# EasyEDA Pro project Hubbly.epro

# Schematic Hubbly
Board Name: Board1; Create Date: 2026-05-22; Page Name: P1; Project Name: Hubbly.; Schematic Name: Hubbly; Update Date: 2026-05-22; Company: EasyEDA.com; Drawn: Youssef Ayman; Page Size: A4; Version: V1.0
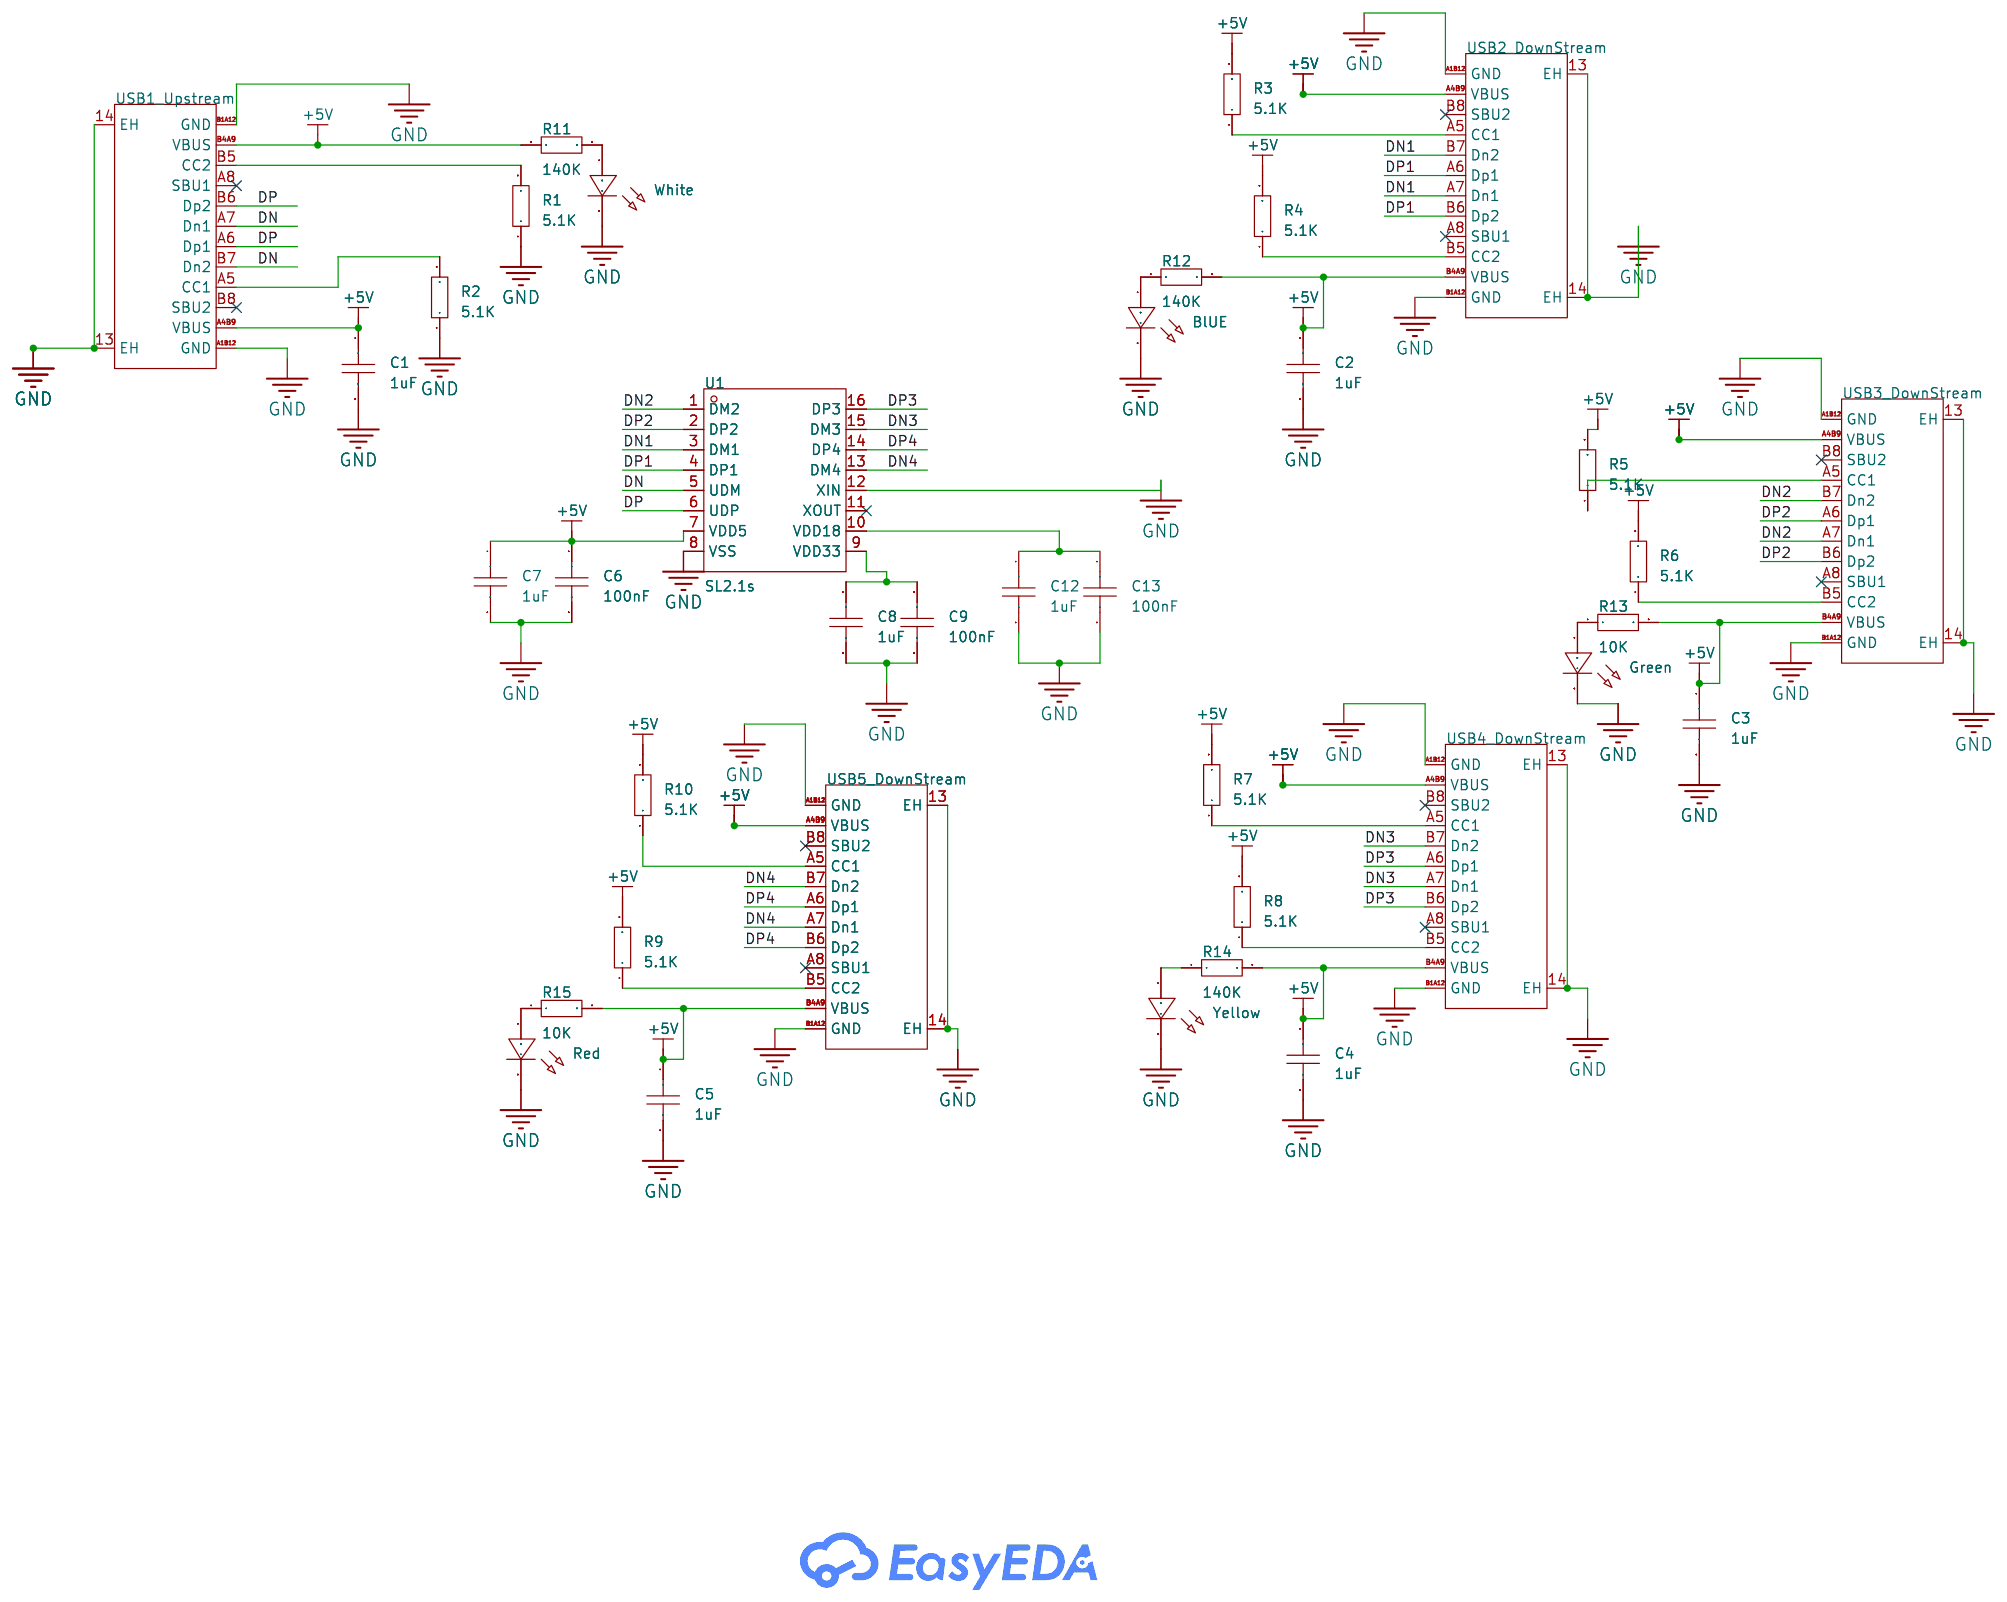
[diagram p0: schematic sheet]

## Parts
BlUE  -  [LED-TH_BD5.0-P2.54-L-RD_WHITE]
C1  1uF  [C0603]
C2  1uF  [C0603]
C3  1uF  [C0603]
C4  1uF  [C0603]
C5  1uF  [C0603]
C6  100nF  [C0603]
C7  1uF  [C0603]
C8  1uF  [C0603]
C9  100nF  [C0603]
C12  1uF  [C0603]
C13  100nF  [C0603]
Green  -  [LED-TH_BD5.0-P2.54-L-RD_WHITE]
R1  5.1K  [R0603]
R2  5.1K  [R0603]
R3  5.1K  [R0603]
R4  5.1K  [R0603]
R5  5.1K  [R0603]
R6  5.1K  [R0603]
R7  5.1K  [R0603]
R8  5.1K  [R0603]
R9  5.1K  [R0603]
R10  5.1K  [R0603]
R11  140K  [R0603]
R12  140K  [R0603]
R13  10K  [R0603]
R14  140K  [R0603]
R15  10K  [R0603]
Red  -  [LED-TH_BD5.0-P2.54-L-RD_WHITE]
U1  SL2.1s  [SSOP-16_L4.6-W2.6-P0.53-LS4.0-BL]
USB1_Upstream  TYPE-C 16PIN 2MD(073)  [USB-C-SMD_TYPE-C-16PIN-2MD-073]
USB2_DownStream  TYPE-C 16PIN 2MD(073)  [USB-C-SMD_TYPE-C-16PIN-2MD-073]
USB3_DownStream  TYPE-C 16PIN 2MD(073)  [USB-C-SMD_TYPE-C-16PIN-2MD-073]
USB4_DownStream  TYPE-C 16PIN 2MD(073)  [USB-C-SMD_TYPE-C-16PIN-2MD-073]
USB5_DownStream  TYPE-C 16PIN 2MD(073)  [USB-C-SMD_TYPE-C-16PIN-2MD-073]
White  -  [LED-TH_BD5.0-P2.54-L-RD_WHITE]
Yellow  -  [LED-TH_BD5.0-P2.54-L-RD_WHITE]

## Library data of the parts
BlUE Green Red White Yellow = LED_TH-B_5mm: Supplier Footprint: Through
C1-C9 C12 C13 = CAP_0603: Supplier Footprint: 0603
R1-R15 = Res_0603: Supplier Footprint: 0603
U1 = SL2.1s: type:Hub USB Protocol:USB 2.0 Data Rate:- Voltage - Supply:4V~5.25V Voltage - Supply:4V~5.25V Operating Temperature:0℃~+70℃ Operating Temperature:0℃~+70℃ Memory Interface:- Current - Supply:120mA Quiescent Supply Current:2.5mA Number of Channels:4; LCSC Part Name: USB2.0 HUB控制器集成电路; Supplier Part: C2684433; Manufacturer: CoreChips(和芯润德); Supplier Footprint: SSOP-16; JLCPCB Part Class: Extended Part; Datasheet: https://item.szlcsc.com/datasheet/SL2.1s/2782346.html; Supplier: LCSC; type: Hub; USB Protocol: USB 2.0; Voltage - Supply: 4V~5.25V; Operating Temperature: 0℃~+70℃; Current - Supply: 120mA; Quiescent Supply Current: 2.5mA; Number of Channels: 4
USB1_Upstream USB2_DownStream USB3_DownStream USB4_DownStream USB5_DownStream = TYPE-C 16PIN 2MD(073): Connector Type:Type-C Protocol Standard:- Gender:Female Mounting Type:Surface Mount, Right Angle Number of Contacts:16P Number of Ports:1 Current Rating-Power:3A Voltage Rating:5V Connect-Disconnect Life:10,000 Cycles Supplementary Features:- Center Heigh; LCSC Part Name: Type-C 母 卧贴; Supplier Part: C2765186; Manufacturer: SHOU HAN(首韩); Supplier Footprint: SMD; JLCPCB Part Class: Extended Part; Datasheet: https://item.szlcsc.com/datasheet/TYPE-C%252016PIN%25202MD(073)/2901843.html; Supplier: LCSC; Connector Type: Type-C; Gender: Female; Mounting Type: Surface Mount, Right Angle; Number of Contacts: 16P; Number of Ports: 1; Current Rating-Power: 3A; Voltage Rating: 5V; Connect-Disconnect Life: 10,000 Cycles; Detection color: Black; Operating Temperature: -25℃~+85℃

## Nets
+5V: C1.1 C2.1 C3.1 C4.1 C5.1 C6.1 C7.1 R3.2 R4.2 R5.2 R6.2 R7.2 R8.2 R9.2 R10.2 R11.1 R12.2 R13.2 R14.2 R15.2 U1.7(VDD5) USB1_Upstream.A4B9(VBUS) USB1_Upstream.B4A9(VBUS) USB2_DownStream.A4B9(VBUS) USB2_DownStream.B4A9(VBUS) USB3_DownStream.A4B9(VBUS) USB3_DownStream.B4A9(VBUS) USB4_DownStream.A4B9(VBUS) USB4_DownStream.B4A9(VBUS) USB5_DownStream.A4B9(VBUS) USB5_DownStream.B4A9(VBUS)
GND: BlUE.2(A) C1.2 C2.2 C3.2 C4.2 C5.2 C6.2 C7.2 C8.2 C9.2 C12.2 C13.2 Green.2(A) R1.1 R2.1 Red.2(A) U1.8(VSS) U1.12(XIN) USB1_Upstream.13(EH) USB1_Upstream.14(EH) USB1_Upstream.A1B12(GND) USB1_Upstream.B1A12(GND) USB2_DownStream.13(EH) USB2_DownStream.14(EH) USB2_DownStream.A1B12(GND) USB2_DownStream.B1A12(GND) USB3_DownStream.13(EH) USB3_DownStream.14(EH) USB3_DownStream.A1B12(GND) USB3_DownStream.B1A12(GND) USB4_DownStream.13(EH) USB4_DownStream.14(EH) USB4_DownStream.A1B12(GND) USB4_DownStream.B1A12(GND) USB5_DownStream.13(EH) USB5_DownStream.14(EH) USB5_DownStream.A1B12(GND) USB5_DownStream.B1A12(GND) White.2(A) Yellow.2(A)
DN: U1.5(UDM) USB1_Upstream.A7(Dn1) USB1_Upstream.B7(Dn2)
DN1: U1.3(DM1) USB2_DownStream.A7(Dn1) USB2_DownStream.B7(Dn2)
DN2: U1.1(DM2) USB3_DownStream.A7(Dn1) USB3_DownStream.B7(Dn2)
DN3: U1.15(DM3) USB4_DownStream.A7(Dn1) USB4_DownStream.B7(Dn2)
DN4: U1.13(DM4) USB5_DownStream.A7(Dn1) USB5_DownStream.B7(Dn2)
DP: U1.6(UDP) USB1_Upstream.A6(Dp1) USB1_Upstream.B6(Dp2)
DP1: U1.4(DP1) USB2_DownStream.A6(Dp1) USB2_DownStream.B6(Dp2)
DP2: U1.2(DP2) USB3_DownStream.A6(Dp1) USB3_DownStream.B6(Dp2)
DP3: U1.16(DP3) USB4_DownStream.A6(Dp1) USB4_DownStream.B6(Dp2)
DP4: U1.14(DP4) USB5_DownStream.A6(Dp1) USB5_DownStream.B6(Dp2)
$1N3672: C8.1 C9.1 U1.9(VDD33)
$1N3693: C12.1 C13.1 U1.10(VDD18)
$1N4044: R11.2 White.1(C)
$1N4129: BlUE.1(C) R12.1
$1N4291: R14.1 Yellow.1(C)
$1N4469: R15.1 Red.1(C)
$1N4529: Green.1(C) R13.1
Net-(R1-2): R1.2 USB1_Upstream.B5(CC2)
Net-(R2-2): R2.2 USB1_Upstream.A5(CC1)
Net-(R3-1): R3.1 USB2_DownStream.A5(CC1)
Net-(R4-1): R4.1 USB2_DownStream.B5(CC2)
Net-(R5-1): R5.1 USB3_DownStream.A5(CC1)
Net-(R6-1): R6.1 USB3_DownStream.B5(CC2)
Net-(R7-1): R7.1 USB4_DownStream.A5(CC1)
Net-(R8-1): R8.1 USB4_DownStream.B5(CC2)
Net-(R9-1): R9.1 USB5_DownStream.B5(CC2)
Net-(R10-1): R10.1 USB5_DownStream.A5(CC1)

Not connected (* = marked no-connect by the designer): U1 11(XOUT)*; USB1_Upstream A8(SBU1)* B8(SBU2)*; USB2_DownStream A8(SBU1)* B8(SBU2)*; USB3_DownStream A8(SBU1)* B8(SBU2)*; USB4_DownStream A8(SBU1)* B8(SBU2)*; USB5_DownStream A8(SBU1)* B8(SBU2)*

# Board PCB1
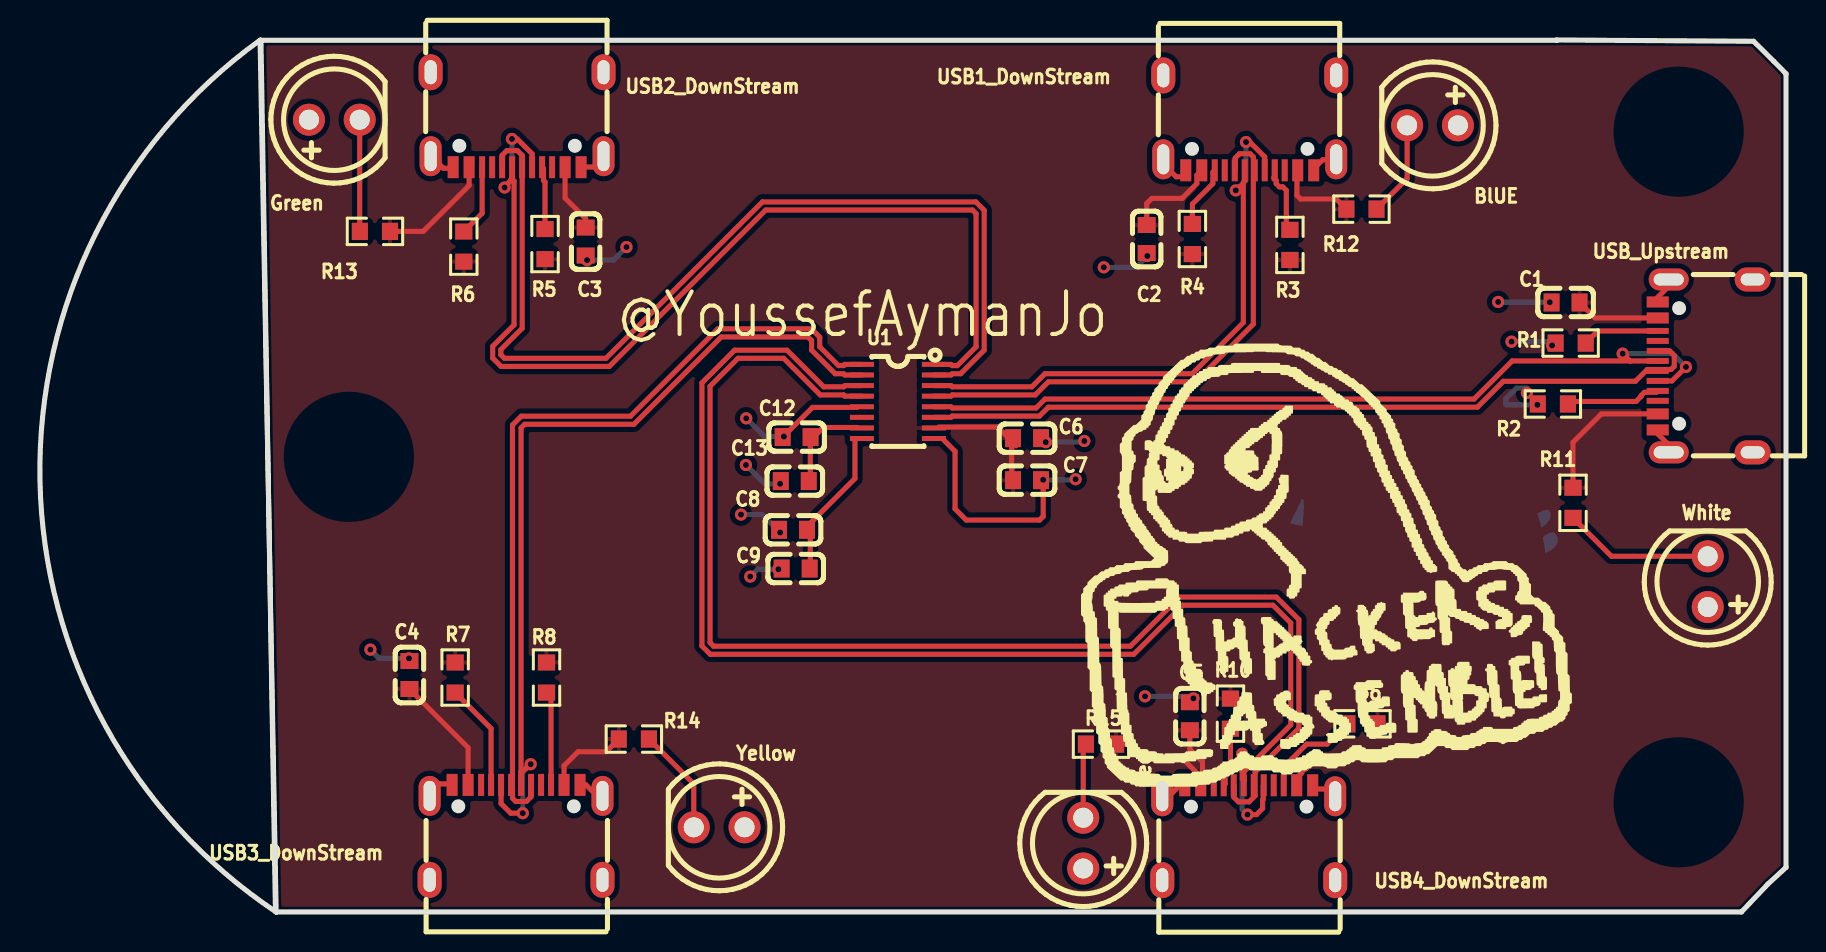
[diagram p1: board, top side]
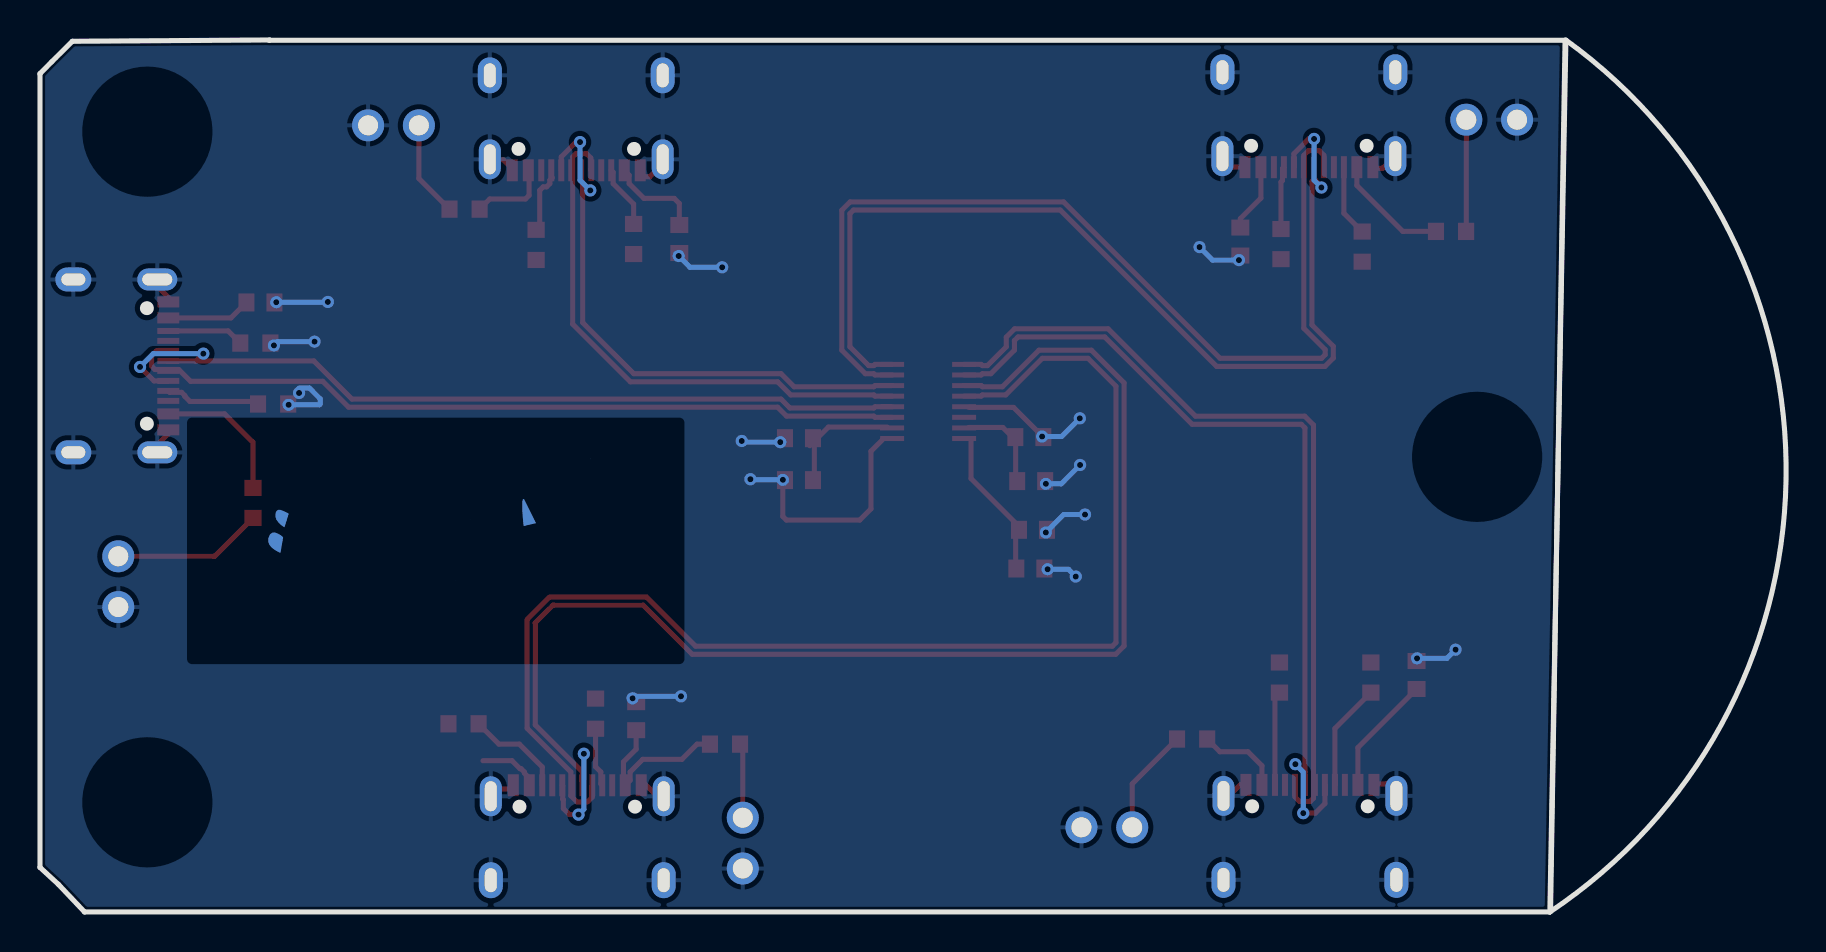
[diagram p2: board, bottom side, seen from below]

Outline 87.35 x 43.63 mm; copper layers: Top Layer, Bottom Layer. Coordinates in mm from the lower left corner of the outline.
Outline path: 11.05,43.61 arc(11.06,43.62) 11.07,43.62 75.89,43.62 75.86,43.63 85.72,43.57 arc(85.73,43.57) 85.73,43.56 86.75,42.55 87.34,41.95 arc(87.35,41.94) 87.35,41.94 87.35,2.24 arc(87.35,2.23) 87.34,2.23 86.43,1.39 85.12,0.01 arc(85.12,0) 85.11,0 11.83,0 arc(11.83,0) 11.82,0.01 11.79,0.03 arc(11.78,0.03) 11.78,0.04 11.05,43.61 ; 11.82,0 11.01,43.63 arc(0,21.6) 11.82,0
Stack: Top Layer 0.035mm / Dielectric1 1.51mm FR4 er 4.5 / Bottom Layer 0.035mm

## Design rules (mm)
net DP2: DP3
net DN1: DP2
net DP1: DP2
net DN: DP1
net DP: DP1
net DN4: DP5
net DP4: DP5
net DN3: DP4
net DP3: DP4
net DN2: DP3
template: Custom Config
spacing copperThickness1oz (default): track to track 0.102, other pairs 0.152 to 0.3
spacing copperThickness2oz: track to track 0.203, other pairs 0.152 to 0.3
track width copperThickness1oz (default): min 0.127, default 0.254, max 2.54
track width copperThickness2oz: min 0.203, default 0.254, max 2.54
differential pair differentialPair (default): width min 0.127, default 0.254, max 2.54; gap min 0.152, default 0.152
via viaSize (default): diameter min 0.5, default 0.61, max 10; hole min 0.3, default 0.305, max 6.3

## Placement (name value [footprint] x y rotation side)
BlUE  -  [LED-TH_BD5.0-P2.54-L-RD_WHITE]  69.66 39.36 0 top
C1  1uF  [C0603]  76.32 30.5 180 top
C2  1uF  [C0603]  55.37 33.67 270 top
C3  1uF  [C0603]  27.3 33.55 270 top
C4  1uF  [C0603]  18.48 11.86 90 top
C5  1uF  [C0603]  57.52 9.8 90 top
C6  100nF  [C0603]  49.38 23.71 0 top
C7  1uF  [C0603]  49.38 21.61 0 top
C8  1uF  [C0603]  37.67 19.12 180 top
C9  100nF  [C0603]  37.8 17.19 180 top
C12  1uF  [C0603]  37.85 23.76 180 top
C13  100nF  [C0603]  37.76 21.56 180 top
Green  -  [LED-TH_BD5.0-P2.54-L-RD_WHITE]  14.73 39.64 180 top
R1  5.1K  [R0603]  76.57 28.47 0 top
R2  5.1K  [R0603]  75.69 25.42 0 top
R3  5.1K  [R0603]  62.53 33.38 270 top
R4  5.1K  [R0603]  57.65 33.67 270 top
R5  5.1K  [R0603]  25.27 33.42 270 top
R6  5.1K  [R0603]  21.2 33.29 270 top
R7  5.1K  [R0603]  20.77 11.73 90 top
R8  5.1K  [R0603]  25.34 11.73 90 top
R9  5.1K  [R0603]  66.16 9.42 0 top
R10  5.1K  [R0603]  59.56 9.92 90 top
R11  140K  [R0603]  76.69 20.47 270 top
R12  140K  [R0603]  66.11 35.17 180 top
R13  10K  [R0603]  16.76 34.05 0 top
R14  140K  [R0603]  29.71 8.66 180 top
R15  10K  [R0603]  53.08 8.4 0 top
Red  -  [LED-TH_BD5.0-P2.54-L-RD_WHITE]  52.19 3.45 270 top
U1  SL2.1s  [SSOP-16_L4.6-W2.6-P0.53-LS4.0-BL]  42.92 25.55 90 top
USB1_DownStream  TYPE-C 16PIN 2MD(073)  [USB-C-SMD_TYPE-C-16PIN-2MD-073]  60.52 39.49 180 top
USB2_DownStream  TYPE-C 16PIN 2MD(073)  [USB-C-SMD_TYPE-C-16PIN-2MD-073]  23.87 39.64 180 top
USB3_DownStream  TYPE-C 16PIN 2MD(073)  [USB-C-SMD_TYPE-C-16PIN-2MD-073]  23.82 3.98 0 top
USB4_DownStream  TYPE-C 16PIN 2MD(073)  [USB-C-SMD_TYPE-C-16PIN-2MD-073]  60.47 3.97 0 top
USB_Upstream  TYPE-C 16PIN 2MD(073)  [USB-C-SMD_TYPE-C-16PIN-2MD-073]  83.31 27.32 90 top
White  -  [LED-TH_BD5.0-P2.54-L-RD_WHITE]  83.43 16.53 270 top
Yellow  -  [LED-TH_BD5.0-P2.54-L-RD_WHITE]  33.98 4.24 0 top

## Footprints (pads in the part's own frame, mm; a bottom-side part is the same pattern mirrored in y, then rotated)
C0603
  rect 0.8x0.9 smd: 1(-0.7,0) 2(0.7,0)
LED-TH_BD5.0-P2.54-L-RD_WHITE
  round 1.6 hole 1: 1(-1.27,0) 2(1.27,0)
R0603
  rect 0.806x0.864 smd: 1(-0.753,0) 2(0.753,0)
SSOP-16_L4.6-W2.6-P0.53-LS4.0-BL
  rect 0.25x1.2 smd: 1(1.855,-1.8) 2(1.325,-1.8) 3(0.795,-1.8) 4(0.265,-1.8) 5(-0.265,-1.8) 6(-0.795,-1.8) 7(-1.325,-1.8) 8(-1.855,-1.8) 9(-1.855,1.8) 10(-1.325,1.8) 11(-0.795,1.8) 12(-0.265,1.8) 13(0.265,1.8) 14(0.795,1.8) 15(1.325,1.8) 16(1.855,1.8)
USB-C-SMD_TYPE-C-16PIN-2MD-073
  oval 1.1x2 hole 0.6x1.5: 13(-4.325,1.825) 14(4.325,1.825)
  oval 1.2x1.8 hole 0.6x1.2: 13(-4.325,-2.375) 14(4.325,-2.375)
  rect 0.55x1.1 smd: A1B12(-3.2,2.375) A4B9(-2.4,2.375) B1A12(3.2,2.375) B4A9(2.4,2.375)
  rect 0.3x1.1 smd: A5(-1.25,2.375) A6(-0.25,2.375) A7(0.25,2.375) A8(1.25,2.375) B5(1.75,2.375) B6(0.75,2.375) B7(-0.75,2.375) B8(-1.75,2.375)

## Nets
+5V: C1.1 C2.1 C3.1 C4.1 C5.1 C6.1 C7.1 R3.2 R4.2 R5.2 R6.2 R7.2 R8.2 R9.2 R10.2 R11.1 R12.2 R13.2 R14.2 R15.2 U1.7 USB1_DownStream.A4B9 USB1_DownStream.B4A9 USB2_DownStream.A4B9 USB2_DownStream.B4A9 USB3_DownStream.A4B9 USB3_DownStream.B4A9 USB4_DownStream.A4B9 USB4_DownStream.B4A9 USB_Upstream.A4B9 USB_Upstream.B4A9
GND: BlUE.2 C1.2 C2.2 C3.2 C4.2 C5.2 C6.2 C7.2 C8.2 C9.2 C12.2 C13.2 Green.2 R1.1 R2.1 Red.2 U1.8 U1.12 USB1_DownStream.13 USB1_DownStream.14 USB1_DownStream.A1B12 USB1_DownStream.B1A12 USB2_DownStream.13 USB2_DownStream.14 USB2_DownStream.A1B12 USB2_DownStream.B1A12 USB3_DownStream.13 USB3_DownStream.14 USB3_DownStream.A1B12 USB3_DownStream.B1A12 USB4_DownStream.13 USB4_DownStream.14 USB4_DownStream.A1B12 USB4_DownStream.B1A12 USB_Upstream.13 USB_Upstream.14 USB_Upstream.A1B12 USB_Upstream.B1A12 White.2 Yellow.2
DN: U1.5 USB_Upstream.A7 USB_Upstream.B7
DN1: U1.3 USB1_DownStream.A7 USB1_DownStream.B7
DN2: U1.1 USB2_DownStream.A7 USB2_DownStream.B7
DN3: U1.15 USB3_DownStream.A7 USB3_DownStream.B7
DN4: U1.13 USB4_DownStream.A7 USB4_DownStream.B7
DP: U1.6 USB_Upstream.A6 USB_Upstream.B6
DP1: U1.4 USB1_DownStream.A6 USB1_DownStream.B6
DP2: U1.2 USB2_DownStream.A6 USB2_DownStream.B6
DP3: U1.16 USB3_DownStream.A6 USB3_DownStream.B6
DP4: U1.14 USB4_DownStream.A6 USB4_DownStream.B6
$1N993: R1.2 USB_Upstream.B5
$1N1024: R2.2 USB_Upstream.A5
$1N1413: R3.1 USB1_DownStream.A5
$1N1419: R4.1 USB1_DownStream.B5
$1N2562: R5.1 USB2_DownStream.A5
$1N2564: R6.1 USB2_DownStream.B5
$1N2806: R7.1 USB3_DownStream.A5
$1N2808: R8.1 USB3_DownStream.B5
$1N3085: R9.1 USB4_DownStream.B5
$1N3142: R10.1 USB4_DownStream.A5
$1N3672: C8.1 C9.1 U1.9
$1N3693: C12.1 C13.1 U1.10
$1N4044: R11.2 White.1
$1N4129: BlUE.1 R12.1
$1N4291: R14.1 Yellow.1
$1N4469: R15.1 Red.1
$1N4529: Green.1 R13.1

Pads without a net: U1 11; USB1_DownStream A8 B8; USB2_DownStream A8 B8; USB3_DownStream A8 B8; USB4_DownStream A8 B8; USB_Upstream A8 B8

## Via types
v1: diameter 0.61, hole 0.305, Top Layer to Bottom Layer, 36 vias

## Routing (per net, layer and track width the routed paths; a pad name or vN(x,y) marks a point on that pad's centre or on a via; arc(x,y) is an arc through that point)
+5V: length 57.2
  Top Layer w0.254: C5.1 57.52,8.15 58.16,7.51 58.16,6.43 USB4_DownStream.A4B9 57.82,6.59 57.82,7.01 57.19,7.64 55.24,7.64 54.48,8.4 R15.2 ; USB2_DownStream.B4A9 21.47,36.35 19.17,34.05 R13.2 ; C1.1 77.8,29.72 USB_Upstream.B4A9 ; USB2_DownStream.A4B9 26.27,35.72 27.3,34.69 C3.1 ; 48.61,23.56 48.61,21.57 ; 48.61,23.56 47.9,24.26 44.97,24.26 ; 48.61,23.56 48.61,23.75 ; 48.61,23.56 48.84,23.33 ; C2.1 55.37,35.45 55.62,35.71 57.13,35.71 57.87,36.45 57.87,36.87 USB1_DownStream.B4A9 ; USB1_DownStream.A4B9 62.88,37.07 62.88,35.86 63.06,35.68 64.85,35.68 R12.2 ; 62.87,6.71 63.12,6.95 63.12,7.01 63.28,7.17 63.34,7.17 63.74,7.57 65.19,7.57 ; USB3_DownStream.B4A9 26.22,7.32 26.92,8.02 28.32,8.02 R14.2 ; USB_Upstream.A4B9 78.11,24.92 76.69,23.51 R11.1 ; USB3_DownStream.A4B9 21.42,8.22 C4.1
GND: length 57.3
  Top Layer w0.254: 27.96,5.71 27.31,6.37 27,6.37 ; 56.27,5.59 57.28,6.59 ; 45.22,23.61 45.78,23.05 45.78,20.17 46.34,19.61 50.01,19.61 50.19,19.79 50.19,21.58 ; 28.41,37.64 28.05,37.28 27.07,37.28 ; 64.86,37.64 64.17,37.64 63.67,37.14 ; 80.79,24.06 81.37,23.48 81.37,23 ; 80.76,30.59 81.8,31.63 81.8,31.65 ; 64.74,6.16 63.78,6.16 63.61,6.33 ; 20.54,6.41 20,6.41 19.43,5.85 ; 55.99,37.64 56.84,36.79 57.34,36.79 ; 20.58,37.21 20.18,37.21 19.49,37.91 ; 37.2,23.81 38.64,25.25 40.88,25.25
  Bottom Layer w0.254: v1(37.03,18.99) 36.13,19.89 v1(35.07,19.89) ; v1(52.24,23.57) 52.19,23.51 v1(50.31,23.51) ; v1(75.53,30.51) 72.96,30.51 v1(72.95,30.52) ; v1(29.34,33.27) 28.69,32.62 v1(27.37,32.62) ; v1(55.4,32.82) 54.83,32.26 v1(53.22,32.26) ; v1(35.33,24.7) 36.24,23.79 v1(37.22,23.79) ; v1(57.7,10.69) 57.6,10.79 v1(55.28,10.79) ; v1(73.61,28.54) 75.46,28.54 v1(75.65,28.35) ; v1(37.03,21.43) 36.26,21.43 v1(35.32,22.37) ; v1(51.81,21.65) 51.78,21.63 v1(50.18,21.63) ; v1(74.91,25.38) 73.37,25.38 73.33,25.42 73.33,25.68 73.87,26.22 74.39,26.22 ; v1(36.94,17.15) 35.9,17.15 v1(35.53,16.78) ; v1(18.46,12.69) 16.97,12.69 v1(16.53,13.13)
  vias: v1(74.39,25.97)
DN: length 43
  Top Layer w0.254: v1(82.34,27.27) 81.64,26.57 USB_Upstream.B7 ; 81.01,27.57 USB_Upstream.A7 79.56,27.57 ; U1.5 45.57,25.28 45.64,25.22 49.83,25.22 50.28,25.66 71.74,25.66 73.65,27.57 79.54,27.57 ; v1(79.18,27.94) 79.54,27.57 ; 79.54,27.57 79.56,27.55
  Bottom Layer w0.254: v1(79.18,27.94) 81.68,27.94 v1(82.34,27.27)
DN1: length 29.6
  Top Layer w0.254: v1(60.33,38.52) 60.53,38.52 61.27,37.78 USB1_DownStream.B7 ; 60.2,36.45 60.2,29.49 57.64,26.94 50.28,26.94 49.62,26.28 45.64,26.28 45.57,26.34 U1.3 ; 60.2,36.45 60.2,36.5 60.28,36.57 60.28,37.19 ; 60.2,36.45 60.04,36.28 60,36.28 v1(59.82,36.1)
  Bottom Layer w0.254: v1(60.33,38.52) 60.33,36.62 v1(59.82,36.1)
DN2: length 52.2
  Top Layer w0.254: USB2_DownStream.B7 24.62,37.94 23.88,38.68 v1(23.61,38.68) ; 23.62,36.7 USB2_DownStream.A7 23.62,37.45 ; 23.62,36.69 23.63,36.7 ; 23.62,36.69 23.55,36.62 23.55,36.6 23.38,36.44 23.38,36.39 v1(23.24,36.25) ; 23.62,36.69 23.62,36.67 23.72,36.58 23.72,29.38 22.65,28.31 22.65,27.72 23.07,27.3 28.48,27.3 36.31,35.12 46.65,35.12 46.83,34.94 46.83,28.28 45.89,27.34 45.64,27.34 45.57,27.4 U1.1
  Bottom Layer w0.254: v1(23.24,36.25) 23.61,36.62 v1(23.61,38.68)
DN3: length 43.3
  Top Layer w0.254: 24.07,7.03 24.04,7.01 ; 24.07,7.03 24.14,7.03 24.3,7.19 24.34,7.19 v1(24.55,7.4) ; 24.07,7.03 24.07,24.22 24.25,24.4 29.71,24.4 34.08,28.77 38.42,28.77 38.6,28.59 38.6,28.11 39.78,26.93 40.2,26.93 40.27,26.87 U1.15 ; 24.07,7.01 USB3_DownStream.A7 ; v1(24.15,4.95) 23.55,4.95 23.07,5.43 USB3_DownStream.B7
  Bottom Layer w0.254: v1(24.15,4.95) 24.15,7 v1(24.55,7.4)
DN4: length 64.4
  Top Layer w0.254: USB4_DownStream.B7 59.72,5.75 59.96,5.51 60.49,5.51 60.79,5.82 60.79,7.01 62.98,9.19 62.98,14.63 61.85,15.76 57.01,15.76 54.55,13.3 33.7,13.3 33.52,13.48 33.52,26.31 34.92,27.7 37.2,27.7 39.04,25.87 40.2,25.87 40.27,25.81 U1.13
DP: length 39.6
  Top Layer w0.254: USB_Upstream.B6 81.52,28.07 81.76,27.84 81.76,27.31 81.6,27.14 80.41,27.14 79.82,26.55 73.2,26.55 71.91,25.26 50.45,25.26 50,24.81 45.64,24.81 45.57,24.75 U1.6
DP1: length 27.5
  Top Layer w0.254: U1.4 45.57,25.81 45.64,25.87 49.79,25.87 50.45,26.53 57.81,26.53 60.7,29.42 60.7,37.78 60.54,37.94 60,37.94 59.79,37.73 59.79,37.13 USB1_DownStream.B6
DP2: length 49.9
  Top Layer w0.254: U1.2 45.57,26.87 45.64,26.93 46.06,26.93 47.24,28.11 47.24,35.11 46.82,35.53 36.14,35.53 28.31,27.7 23.23,27.7 23.05,27.88 23.05,28.14 24.12,29.21 24.12,37.86 23.88,38.1 23.35,38.1 23.12,37.86 USB2_DownStream.B6
DP3: length 40.9
  Top Layer w0.254: USB3_DownStream.B6 24.57,5.77 24.33,5.53 23.8,5.53 23.64,5.69 23.64,24.37 24.08,24.81 29.54,24.81 33.91,29.18 38.59,29.18 39.01,28.76 39.01,28.28 39.95,27.34 40.2,27.34 40.27,27.4 U1.16
DP4: length 69.1
  Top Layer w0.254: v1(60.14,7.92) 60.14,7.02 60.15,7.01 60.15,6.66 60.22,6.59 ; U1.14 40.27,26.34 40.2,26.28 39.2,26.28 37.37,28.11 34.75,28.11 33.11,26.48 33.11,13.31 33.53,12.89 54.72,12.89 57.18,15.35 61.68,15.35 62.57,14.46 62.57,9.36 60.22,7.01 60.22,6.59 ; 60.22,6.59 60.25,6.57 ; USB4_DownStream.B6 61.2,6.32 61.2,5.65 61.16,5.62 61.16,5.18 60.86,4.88 v1(60.41,4.88)
  Bottom Layer w0.254: v1(60.14,7.92) 60.14,5.14 v1(60.41,4.88)
$1N993: length 3.9
  Top Layer w0.254: USB_Upstream.B5 77.93,29.07 R1.2
$1N1024: length 4.8
  Top Layer w0.254: 76.39,25.55 79.85,25.55 80.1,25.8 80.1,25.84 80.26,26 80.86,26 USB_Upstream.A5
$1N1413: length 2.8
  Top Layer w0.254: 62.35,34.35 62.35,36.11 62.18,36.28 62,36.28 61.84,36.45 61.84,36.62 61.72,36.74
$1N1419: length 3.1
  Top Layer w0.254: USB1_DownStream.B5 58.67,37.02 58.67,36.45 57.65,35.42 R4.1
$1N2562: length 3.2
  Top Layer w0.254: USB2_DownStream.A5 25.19,37.2 25.19,36.6 25.27,36.53 R5.1
$1N2564: length 3.6
  Top Layer w0.254: USB2_DownStream.B5 22.12,34.96 R6.1
$1N2806: length 5.4
  Top Layer w0.254: R7.1 22.57,9.18 USB3_DownStream.A5
$1N2808: length 4.7
  Top Layer w0.254: USB3_DownStream.B5 25.57,10.75 R8.1
$1N3085: length 5
  Top Layer w0.254: R9.1 64.39,8.4 63.37,8.4 62.22,7.26 USB4_DownStream.B5
$1N3142: length 3
  Top Layer w0.254: USB4_DownStream.A5 59.29,6.41 59.29,7.01 59.56,7.27 R10.1
$1N3672: length 7.1
  Top Layer w0.254: 38.34,19.26 40.77,21.69 40.77,23.67 ; 38.54,18.87 38.54,17.26 38.48,17.2
$1N3693: length 4.7
  Top Layer w0.254: 38.63,23.7 39.18,24.24 40.89,24.24 ; 38.36,21.64 38.54,21.81 38.54,23.78
$1N4044: length 7.5
  Top Layer w0.254: White.1 78.61,17.8 R11.2
$1N4129: length 4.8
  Top Layer w0.254: R12.1 68.39,36.7 BlUE.1
$1N4291: length 5.3
  Top Layer w0.254: R14.1 32.71,6.41 Yellow.1
$1N4469: length 3.7
  Top Layer w0.254: R15.1 52.19,8.27 Red.1
$1N4529: length 5.6
  Top Layer w0.254: Green.1 16,34.06 R13.1

## Copper pours and planes (outline as drawn; the poured copper is in the pictures)
+5V on Top Layer: -7.08,45.36 89.71,45.36 89.71,-4.53 -7.08,-4.53
GND on Bottom Layer: -8.4,44.86 90.21,44.86 90.21,-5.52 -8.4,-5.52

Small or netless copper shapes (teardrops, artwork), in the pictures only: 7 on Bottom Layer

## Text on the board
Top Silkscreen Layer: @YoussefAymanJo
